# Altium schematic sheet RELAY12.SchDoc
size A
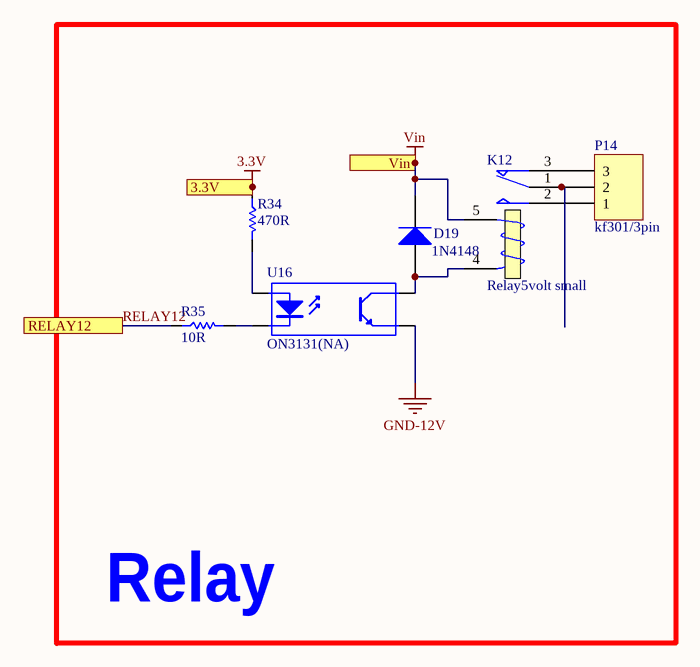
[diagram p0: RELAY12.SchDoc]

## Parts
D19  1N4148  [sod123]
K12  Relay5volt small  [relay5_childern]
P14  kf301/3pin  [Blue Connector 1*3 -kf301]
R34  470R  [0805/resistor]
R35  10R  [0805/resistor]
U16  ON3131(NA)  [OPTO_COUPLER]

## Blocks framed on the sheet
Relay: D19 K12 P14 R34 R35 U16

## Ports
3.3V, RELAY12, Vin

## Nets
3.3V: R34.1 ; port 3.3V
GND-12V: U16.3(E)
Vin: D19.K K12.5 ; port Vin
RELAY12: R35.1 ; port RELAY12
NetD19_A: D19.A K12.4(T2) U16.4(C)
NetK12_1: K12.1(COM) P14.2
NetK12_2: K12.2(NO) P14.1
NetK12_3: K12.3(T1) P14.3
NetR34_2: R34.2 U16.1(A)
NetR35_2: R35.2 U16.2(K)

## Library data of the parts
D19 = Diode 1N4007: 1 Amp General Purpose Rectifier; Published: 8-Jun-2000; LatestRevisionDate: 17-Jul-2002; LatestRevisionNote: Re-released for DXP Platform.; DatasheetVersion: 1998; PackageVersion: Aug-1999; PackageReference: DO-41; Publisher: Altium Limited; PackageDescription: Diode, Axial; Body 5.2 x 2.7 mm (LxDia. max), Lead Dia. 0.86 mm (max); Code_JEDEC: DO-204-AL; ComponentLink1Description: Manufacturer Link; ComponentLink1URL: http://www.fairchildsemi.com/; ComponentLink2Description: Datasheet; ComponentLink2URL: http://www.fairchildsemi.com/ds/1N%2F1N4001.pdf
K12 = Relay: SPDT Relay; Published: 8-Jun-2000; LatestRevisionDate: 17-Jul-2002; LatestRevisionNote: Re-released for DXP Platform.; PackageReference: MODULE5B; Publisher: Altium Limited
P14 = Header 3: LatestRevisionDate: 17-Jul-2002; LatestRevisionNote: Re-released for DXP Platform.; Publisher: Altium Limited
R34 R35 = Resistor: Tolerance: 5%; Power: 1/8 W
  R34: Value: 470R
  R35: Value: 10R
U16 = Optoisolator1: 4-Pin Phototransistor Optocoupler; Published: 24-Mar-1999; LatestRevisionDate: 04-Mar-2005; LatestRevisionNote: Sch pins 3 & 4 Swapped.; DatasheetVersion: Nov-2003; PackageReference: DIP-4; Publisher: Altium Limited